# EAGLE design Metro Mini Rev B (EAGLE 9.6.2)
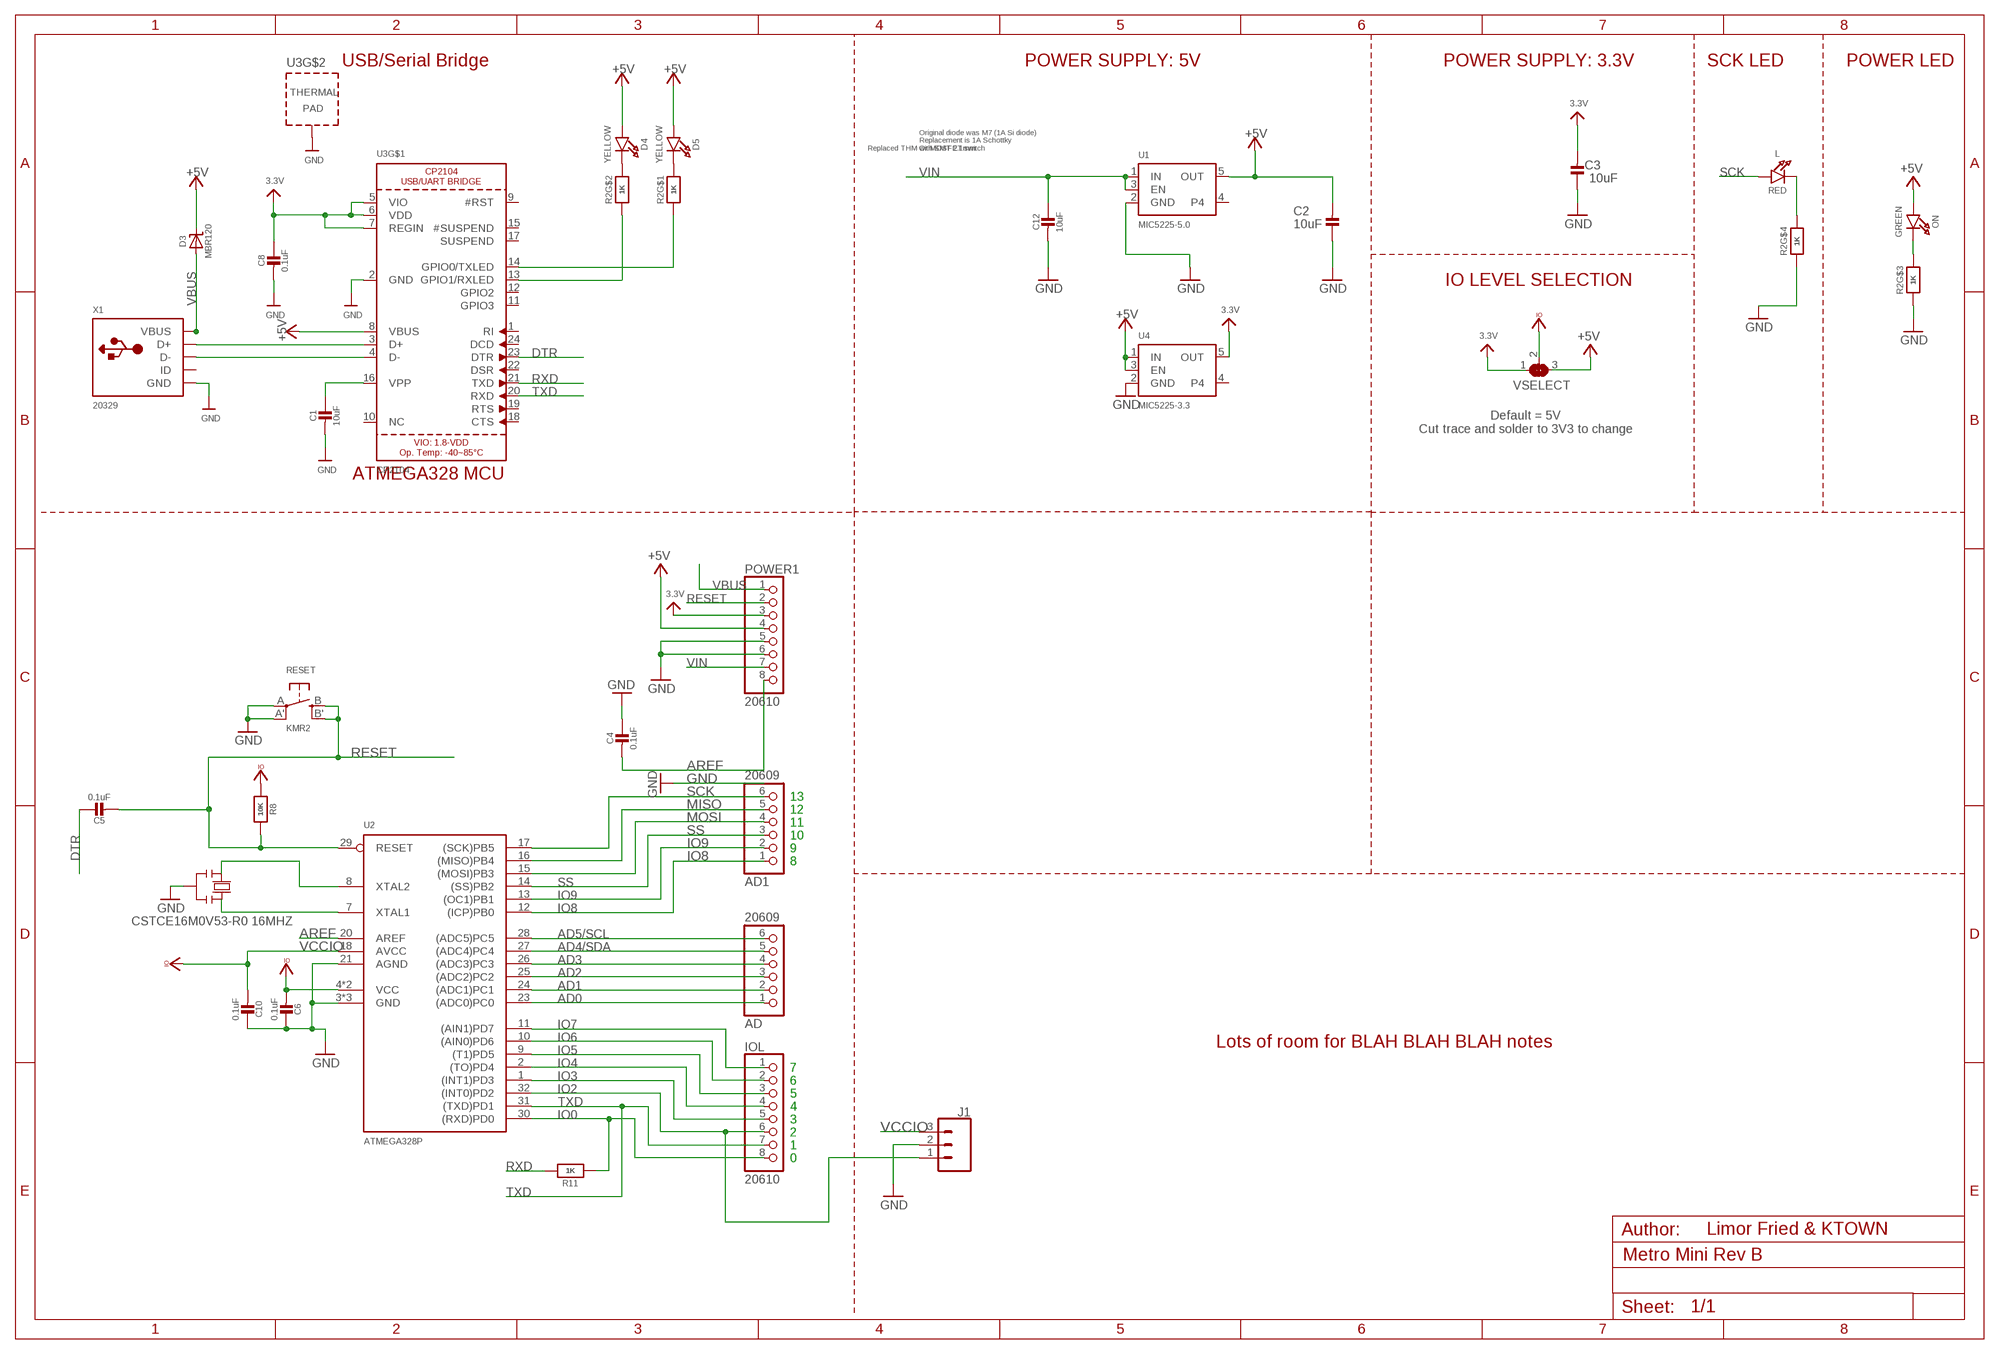
[diagram p0: schematic, sheet 1]

## Parts
AD  20609  HEADER-1X6ROUND  [1X06_ROUND]
AD1  20609  HEADER-1X6ROUND  [1X06_ROUND]
C1  10uF  CAP_CERAMIC0805-NOOUTLINE  [0805-NO]
C2  10uF  CAP_CERAMIC0805-NOOUTLINE  [0805-NO]
C3  10uF  CAP_CERAMIC0805-NOOUTLINE  [0805-NO]
C4  0.1uF  CAP_CERAMIC0805-NOOUTLINE  [0805-NO]
C5  0.1uF  CAP_CERAMIC_0805MP  [_0805MP]
C6  0.1uF  CAP_CERAMIC0805-NOOUTLINE  [0805-NO]
C8  0.1uF  CAP_CERAMIC0805-NOOUTLINE  [0805-NO]
C10  0.1uF  CAP_CERAMIC0805-NOOUTLINE  [0805-NO]
C12  10uF  CAP_CERAMIC0805-NOOUTLINE  [0805-NO]
D3  MBR120  DIODE-SCHOTTKYSOD-123  [SOD-123]
D4  YELLOW  LED0805_NOOUTLINE  [CHIPLED_0805_NOOUTLINE]
D5  YELLOW  LED0805_NOOUTLINE  [CHIPLED_0805_NOOUTLINE]
IOL  20610  HEADER-1X8ROUND  [1X08_ROUND]
J1  CONN_03  [1X03]
L  RED  LED0805_NOOUTLINE  [CHIPLED_0805_NOOUTLINE]
ON  GREEN  LED0805_NOOUTLINE  [CHIPLED_0805_NOOUTLINE]
POWER1  20610  HEADER-1X870MIL  [1X08_ROUND_70]
R2  1K  RESISTOR_4PACK  [RESPACK_4X0603]
R8  10K  RESISTOR0805_NOOUTLINE  [0805-NO]
R11  1K  RESISTOR0805_NOOUTLINE  [0805-NO]
RESET  KMR2  SWITCH_TACT_SMT4.6X2.8  [BTN_KMR2_4.6X2.8]
U1  MIC5225-5.0  VREG_SOT23-5  [SOT23-5]
U2  ATMEGA328P  [MLF32-TH]
U3  CP2104  [QFN24_4MM_SMSC]
U4  MIC5225-3.3  VREG_SOT23-5  [SOT23-5]
VSELECT  SOLDERJUMPER_2WAY  [SOLDERJUMPER_2WAY_OPEN_NOPASTE]
X1  20329  USB_MICRO_20329_V2  [4UCONN_20329_V2]
Y2  CSTCE16M0V53-R0 16MHZ  RESONATORMU  [RESONATOR]

## Nets
3.3V: C3.2 C8.1 POWER1.3 U3.5(VIO) U3.6(VDD) U3.7(REGIN) U4.5(OUT) VSELECT.1
+5V [usbvcc]: C2.2 D3.C D4.A D5.A ON.A POWER1.4 U1.5(OUT) U3.8(VBUS) U4.1(IN) U4.3(EN) VSELECT.3
AD0: AD.1 U2.23((ADC0)PC0)
AD1: AD.2 U2.24((ADC1)PC1)
AD2: AD.3 U2.25((ADC2)PC2)
AD3: AD.4 U2.26((ADC3)PC3)
AD4/SDA: AD.5 U2.27((ADC4)PC4)
AD5/SCL: AD.6 U2.28((ADC5)PC5)
AREF [aref]: C4.2 POWER1.8 U2.20(AREF)
DTR: C5.1 U3.23(DTR)
GND [gnd]: C1.2 C2.1 C3.1 C4.1 C6.1 C8.2 C10.1 C12.2 J1.2 POWER1.5 POWER1.6 R2.3 R2.4 RESET.A'(P1) RESET.A(P) U1.2(GND) U2.3(GND) U2.5(GND) U2.21(AGND) U2.TH(GND) U3.2(GND) U3.THERM(TP) U4.2(GND) X1.BASE@1(GND) X1.BASE@2(GND) X1.GND X1.SPRT@1(GND) X1.SPRT@2(GND) X1.SPRT@3(GND) X1.SPRT@4(GND) Y2.2
IO0: IOL.8 R11.1 U2.30((RXD)PD0)
IO2: IOL.6 J1.1 U2.32((INT0)PD2)
IO3: IOL.5 U2.1((INT1)PD3)
IO4: IOL.4 U2.2((TO)PD4)
IO5: IOL.3 U2.9((T1)PD5)
IO6: IOL.2 U2.10((AIN0)PD6)
IO7: IOL.1 U2.11((AIN1)PD7)
IO8: AD1.1 U2.12((ICP)PB0)
IO9: AD1.2 U2.13((OC1)PB1)
MISO: AD1.5 U2.16((MISO)PB4)
MOSI: AD1.4 U2.15((MOSI)PB3)
N$1: L.C R2.5
N$3: ON.C R2.6
N$4: R2.1 U3.14(GPIO0/TXLED)
N$6: D4.C R2.7
N$7: D5.C R2.8
N$8: U3.3(D+) X1.D+
N$11: U3.4(D-) X1.D-
N$12: C1.1 U3.16(VPP)
N$15: R2.2 U3.13(GPIO1/RXLED)
RESET: C5.2 POWER1.2 R8.1 RESET.B'(S1) RESET.B(S) U2.29(RESET)
RXD: R11.2 U3.21(TXD)
SCK: AD1.6 L.A U2.17((SCK)PB5)
SS: AD1.3 U2.14((SS)PB2)
TXD: IOL.7 U2.31((TXD)PD1) U3.20(RXD)
VBUS: D3.A POWER1.1 X1.VBUS
VCCIO [usbvcc]: C6.2 C10.2 J1.3 R8.2 U2.4(VCC) U2.6(VCC) U2.18(AVCC) VSELECT.2
VIN [power]: C12.1 POWER1.7 U1.1(IN) U1.3(EN)
XTAL1: U2.7(XTAL1) Y2.3
XTAL2: U2.8(XTAL2) Y2.1
Unconnected: U1.4 U3.1(RI) U3.9(#RST) U3.10(NC) U3.11(GPIO3) U3.12(GPIO2) U3.15(#SUSPEND) U3.17(SUSPEND) U3.18(CTS) U3.19(RTS) U3.22(DSR) U3.24(DCD) U4.4 X1.ID

## Notes on the sheet
- USB/Serial Bridge | POWER SUPPLY: 5V | POWER SUPPLY: 3.3V | SCK LED | POWER LED
- Replaced THM with SMT 2.1mm
- Original diode was M7 (1A Si diode)
  Replacement is 1A Schottky
  Or MOSFET switch
- IO LEVEL SELECTION
- Default = 5V
  Cut trace and solder to 3V3 to change
- ATMEGA328 MCU
- 13
- 12
- 11
- 10
- 9
- 8
- Lots of room for BLAH BLAH BLAH notes
- 7
- 6
- 5
- 4
- 3
- 2
- 1
- 0
- Limor Fried & KTOWN

## Library data of the parts
AD AD1 = microbuilder:HEADER-1X6: PIN HEADER
C1-C6 C8 C10 C12 = microbuilder:CAP_CERAMIC: Ceramic Capacitors For new designs, use the packages preceded by an '_' character since they are more reliable: The following footprints should be used on most boards: _0402 - Standard footprint for regular board layouts _0603 - Standard footprint for regular board layouts _0805 - Standard footprint for regular board layouts _1206 - Standard footprint for regular board layouts For extremely tight-pitch boards where space is at a premium, the following 'micro-pitch' footprints can be used (smaller pads, no silkscreen outline, etc.): _0402MP - Micro-pitch footprint for very dense/compact boards _0603MP - Micro-pitch footprint for very dense/compact boards _0805MP - Micro-pitch footprint for very dense/compact boards _1206MP - Micro-pitch footprint for very dense/compact boards
D3 = microbuilder:DIODE-SCHOTTKY
D4 D5 L ON = microbuilder:LED: LED 0603 - 0603 Surface Mount Package 2mA: Green LED - Low Power (3.9mcd, 2ma, 1.7Vf) - Digikey: 475-2709-2-ND Orange LED - Low Power (9.8mcd, 2ma, 1.8Vf) - Digikey: 475-1194-2-ND Red LED - Low Power (5mcd, 2ma, 1.8Vf) - Digikey: 475-1195-2-ND Yellow LED - Low Power (7mcd, 2ma, 1.8Vf) - Digikey: 475-1196-2-ND 5mA: Blue LED - Low Power (17mcd, 5ma, 2.9Vf) - Digikey: LNJ937W8CRACT-ND 0805 - 0805 Surface Mount Package 2mA: Red LED (8.8mcd, 2mA, 1.8Vf, Clear) - Low Power [Digikey: 475-2510-1-ND] Green LED (5mcd, 2mA, 1.8Vf, Clear) - Low Power [Digikey: 475-2730-1-ND] Yellow LED (11.3mcd, 2mA, 1.8Vf, Clear) - Low Power [Digikey: 475-2555-1-ND] 20mA: Red LED (104mcd, 20mA, Diffused) - LS R976 [Digikey: 475-1278-6-ND] Red LED (12mcd, 20mA, 2.0Vf, Clear) - APT2012EC [Digikey: 754-1128-1-ND] Green LED (15mcd, 20mA, 2.2Vf, Clear) - APT2012GC [Digikey: 754-1131-1-ND] Orange LED (160mcd, 20mA, 2.1Vf, Clear) - APT2012SECK [Digikey: 754-1130-1-ND] 1206 - 1206 Surface Mount Package Green LED (26mcd, 20mA, Diffused) - LG N971 [Digikey: 475-1407-6-ND] Red LED (15mcd, 20mA, Diffused) - LH N974 [Digikey: 475-1416-6-ND] Cree - Cree High-Power Surface Mount LEDs XPEBWT-L1-0000-00D50 - White 111lm 350mA 2.9Vf 6200K 110° XTEAWT-00-0000-00000LEE3 - White 114lm 350mA 2.85Vf 5000K 115° Everlight - Everlight 45-21 Series Surface Mount LEDs 45-21/QK2C-B2832AC2CB2/2T - Warm White 2000mcd 20mA 3.25Vf 3050K 120° 45-21/LK2C-B38452C4CB2/2T - Nuetral White 2000mcd 20mA 3.25Vf 4150K 120° 45-21/LK2C-B50634C6CB2/2T - Cold White 2200mcd 20mA 3.25Vf 5650K 120° PLCC2 Reverse Mount LS T77K-J1L2-1-0-2-R18-Z - Red 11.25mcd 2mA 1.8Vf 630nm 120° LO T77K-L1M2-24-Z - Orange 19.6mcd 2mA 1.8Vf 606nm 120° LY T77K-K2M1-26-Z - Yellow 15.7mcd 2mA 1.8Vf 587nm 120°
IOL POWER1 = microbuilder:HEADER-1X8: PIN HEADER
J1 = SparkFun-Connectors:CONN_03: Multi connection point. Often used as Generic Header-pin footprint for 0.1 inch spaced/style header connections On any of the 0.1 inch spaced packages, you can populate with these: Break Away Headers - Straight <https://www.sparkfun.com/products/116> (PRT-00116) Break Away Male Headers - Right Angle <https://www.sparkfun.com/products/553> (PRT-00553) Female Headers <https://www.sparkfun.com/products/115> (PRT-00115) Break Away Headers - Machine Pin <https://www.sparkfun.com/products/117> (PRT-00117) Break Away Female Headers - Swiss Machine Pin <https://www.sparkfun.com/products/743> (PRT-00743) Stackable Header - 3 Pin (Female, 0.1") <https://www.sparkfun.com/products/13875> (PRT-13875) For SCREWTERMINALS and SPRING TERMINALS visit here: Screw Terimnals on SparkFun.com <https://www.sparkfun.com/search/results?term=Screw+Terminals> (5mm/3.5mm/2.54mm spacing) This device is also useful as a general connection point to wire up your design to another part of your project. Our various solder wires solder well into these plated through hole pads. Hook-Up Wire - Assortment (Stranded, 22 AWG) <https://www.sparkfun.com/products/11375> (PRT-11375) Hook-Up Wire - Assortment (Solid Core, 22 AWG) <https://www.sparkfun.com/products/11367> (PRT-11367) View the entire wire category on our website here <https://www.sparkfun.com/categories/141> Special notes: Molex polarized connector foot print use with SKU : PRT-08232 with associated crimp pins and housings.
R2 = microbuilder:RESISTOR_4PACK: Resistor Packs (4 resistors) 4 x 0603 10K 1/16W - Digikey: YC164J-10KCT-ND
R8 R11 = microbuilder:RESISTOR: Resistors For new designs, use the packages preceded by an '_' character since they are more reliable: The following footprints should be used on most boards: _0402 - Standard footprint for regular board layouts _0603 - Standard footprint for regular board layouts _0805 - Standard footprint for regular board layouts _1206 - Standard footprint for regular board layouts For extremely tight-pitch boards where space is at a premium, the following 'micro-pitch' footprints can be used (smaller pads, no silkscreen outline, etc.): _0402MP - Micro-pitch footprint for very dense/compact boards _0603MP - Micro-pitch footprint for very dense/compact boards _0805MP - Micro-pitch footprint for very dense/compact boards _1206MP - Micro-pitch footprint for very dense/compact boards
RESET = microbuilder:SWITCH_TACT_SMT: SMT Tact Switches 6x6mm - Digikey: P12940SCT-ND KMR2 (4.6x2.8mm) - Digikey: 401-1426-1-ND EVQ-PQHB55 - Light Touch, 160GF (4.5x4.5mm) - Digikey: P8090SCT-ND KMT0 - KMT021 NGJ LHS (etc.) IP68/Waterproof - Digikey: CKN10289CT-ND
U1 U4 = microbuilder:VREG_SOT23-5: SOT23-5 Fixed Voltage Regulators Part Current Out V Out V In V Dropout θJA (°C/W) TJ (°C) Digikey Part No. ADP121 150mA 3.3V 3.4-5.5V 0.09V @ 150mA -- -- ADP121-AUJZ33R7CT-ND ADP121 150mA 3.0V 3.1-5.5V 0.09V @ 150mA -- -- ADP121-AUJZ30R7CT-ND ADP122 300mA 3.3V 3.4-5.5V 0.085V @ 300mA -- -- ADP122AUJZ-3.3-R7CT-ND ADP1712 300mA 3.3V 3.5-5.5V 0.17V @ 300mA -- -- ADP1712AUJZ-3.3-R7TR-ND AP7311 (Low Cost) 150mA 3.3V 3.5-6V 0.15V @ 150mA -- -- AP7311-33WG-7DICT-ND LD39015M18R 150mA 1.8V 1.9V-5.5V 0.08V @ 100mA -- -- 497-6977-1-ND LP2985A-33DBVR 150mA 3.3V 3.3-16V 0.28V @ 150mA 206 150 296-18479-1-ND MCP1824T-3302E/OT 300mA 3.3V 3.5V-6V 0.2V @ 300mA -- -- MCP1824T-3302E/OTCT-ND MIC5205-2.5YM5 TR 150mA 2.5V 2.7-16V 0.165V @ 150mA -- -- 576-1257-2-ND MIC5205-3.0YM5 TR 150mA 3.0V 3.2V-16V 0.165V @ 150mA -- -- 576-1258-2-ND MIC5205-3.3YM5 TR 150mA 3.3V 3.5V-16V 0.165V @ 150mA -- -- 576-1259-2-ND TPS780330220 150mA 3.3V+2.2V 3.6-5.5V 250mV Max -- -- 296-23332-1-ND TDA3663/N1,135 100mA 3.3V 3.5-45V 0.18V @ 50mA -- -- 568-5343-1-ND Max operating temp can be calculated using θJA, TJ (max junction temperature), and power in watts. Set the "Maximum Ambient Temperature" until it reaches TJ ("Max Junction Temperature"), which is the absolute limit for safe use of the regulator: Heat Sink Temperature Calculator <http://www.daycounter.com/Calculators/Heat-Sink-Temperature-Calculator.phtml> For example, With 12V source into a 3.3V LP2985 and a 30mA load, we are dissipating (12V-3.3V) * 0.03A = 0.261W. With a θJA of 206 °C/W, a TJ of 150°C, and 261mW we can safely use the chip without a heat sink up to 75°C (=147.1°C Junction Temperature).
U2 = microbuilder:ATMEGA328P: ATMEGA 328P
U3 = microbuilder:CP2104: CP2104 - USB to UART Bridge VDD Output: 3.45V
VSELECT = microbuilder:SOLDERJUMPER_2WAY: 2-Way Solder Jumper
X1 = microbuilder:USB: USB Connectors USBMINIB - Surface Mount Female Mini-B USB Connector 4UConnector: 06564
Y2 = SmartPrj:RESONATOR

## Net classes
1 power: width 0.305 mm, drill 0.483 mm, clearance 0.203 mm
2 gnd: width 0.305 mm, drill 0.483 mm, clearance 0.203 mm
3 usbvcc: width 0.305 mm, drill 0.483 mm, clearance 0.203 mm
4 aref: width 0.254 mm, drill 0.483 mm, clearance 0.203 mm

## Board
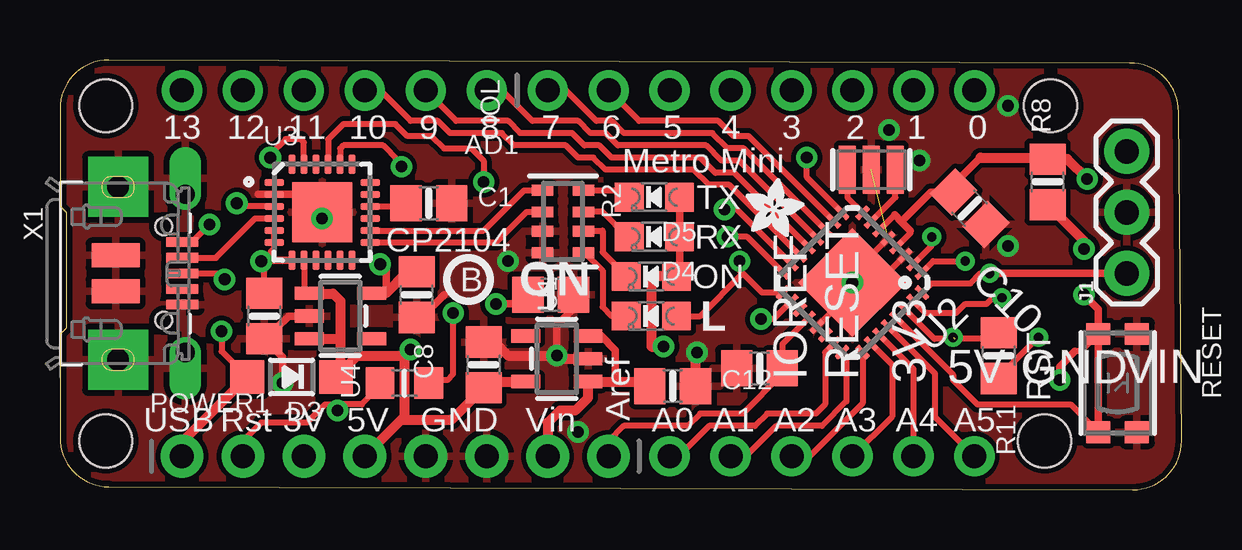
[diagram p1: board, top side]
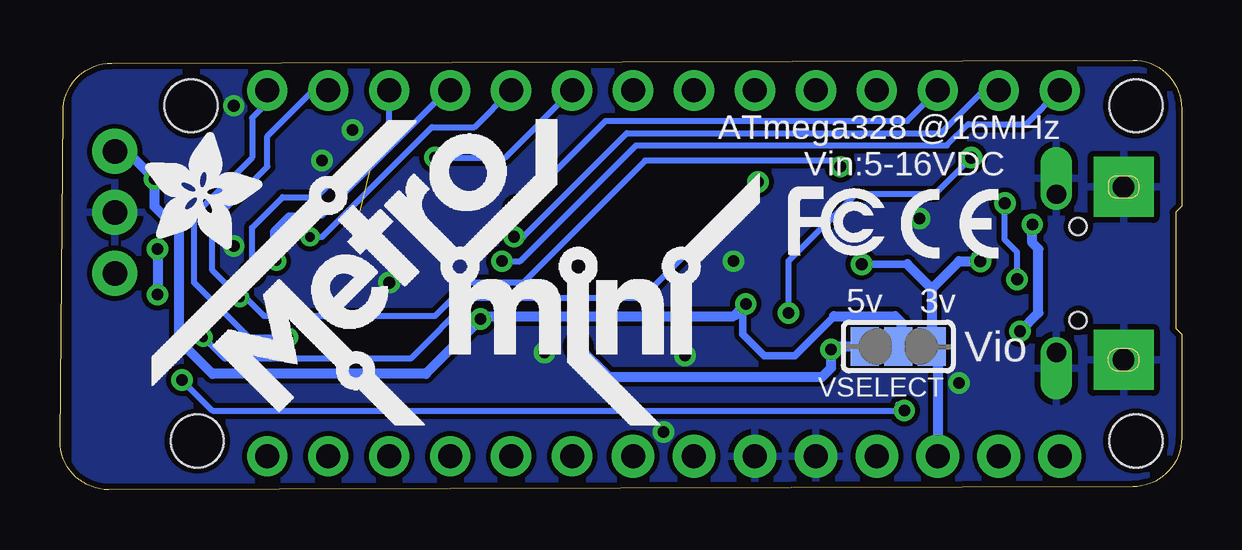
[diagram p2: board, bottom side, seen from below]

Size 46.74 x 17.91 mm. Coordinates in mm from the lower left corner, seen from the top.
Outline: 0,15.88 0,11.81 0.25,11.56 0.25,6.73 0,6.48 0,2.16 arc90 2.03,0.13 44.7,0 arc90 46.74,2.03 46.61,15.75 arc90 44.58,17.78 2.03,17.91 arc90 0,15.88
Copper layers (1*16): Top 0.035mm / dielectric 1.5mm / Bottom 0.035mm
Design rules "adafruit *": minimum track width 8mil, minimum drill 15.5mil, track to track 8mil, track to pad 8mil, pad to pad 8mil, via to via 8mil, smd to smd 8mil, copper to edge 10mil, drill to drill 8mil, minimum pad ring 10mil, minimum via ring 8mil, stop-mask expansion 2mil, vias tented up to drill 20mil, thermal gap 10mil
Holes 2.2 mm at 1.91,16 1.91,2.03 41.27,16 41.02,2.03

### Footprints (pad centres in the part's own frame; a part is rotated, then mirrored left to right if it is on the bottom)
1X06_ROUND = drill 1 pad 1.676: 1 -6.35,0; 2 -3.81,0; 3 -1.27,0; 4 1.27,0; 5 3.81,0; 6 6.35,0
0805-NO = smd 1.3 x 1.5: 1 -0.95,0; 2 0.95,0
_0805MP = smd 1.2 x 1.3: 1 -1.016,0; 2 1.016,0
SOD-123 = smd 1.4 x 1.4: A 1.85,0; C -1.85,0
CHIPLED_0805_NOOUTLINE = smd 1.2 x 1.2: A 0,-1.05; C 0,1.05
1X08_ROUND = drill 1 pad 1.676: 1 -8.89,0; 2 -6.35,0; 3 -3.81,0; 4 -1.27,0; 5 1.27,0; 6 3.81,0; 7 6.35,0; 8 8.89,0
1X03 = drill 1.016 pad 1.88: 1 0,0; 2 2.54,0; 3 5.08,0
1X08_ROUND_70 = drill 1 pad 1.778: 1 -8.89,0; 2 -6.35,0; 3 -3.81,0; 4 -1.27,0; 5 1.27,0; 6 3.81,0; 7 6.35,0; 8 8.89,0
RESPACK_4X0603 = smd 0.45 x 0.9: 1 -1.3,-0.85; 2 -0.4,-0.85; 3 0.4,-0.85; 4 1.3,-0.85; 5 1.3,0.85; 6 0.4,0.85; 7 -0.4,0.85; 8 -1.3,0.85
BTN_KMR2_4.6X2.8 = smd 0.9 x 1: A 2.05,0.8; A' -2.05,0.8; B 2.05,-0.8; B' -2.05,-0.8
SOT23-5 = smd 0.55 x 1.2: 1 -0.95,-1.3; 2 0,-1.3; 3 0.95,-1.3; 4 0.95,1.3; 5 -0.95,1.3
MLF32-TH = smd 0.7 x 0.25: 1 -2.35,1.75; 2 -2.35,1.25; 3 -2.35,0.75; 4 -2.35,0.25; 5 -2.35,-0.25; 6 -2.35,-0.75; 7 -2.35,-1.25; 8 -2.35,-1.75; 17 2.35,-1.75; 18 2.35,-1.25; 19 2.35,-0.75; 20 2.35,-0.25; 21 2.35,0.25; 22 2.35,0.75; 23 2.35,1.25; 24 2.35,1.75 | smd 0.25 x 0.7: 9 -1.75,-2.35; 10 -1.25,-2.35; 11 -0.75,-2.35; 12 -0.25,-2.35; 13 0.25,-2.35; 14 0.75,-2.35; 15 1.25,-2.35; 16 1.75,-2.35; 25 1.75,2.35; 26 1.25,2.35; 27 0.75,2.35; 28 0.25,2.35; 29 -0.25,2.35; 30 -0.75,2.35; 31 -1.25,2.35; 32 -1.75,2.35 | smd 3.2 x 3.2: TH 0,0
QFN24_4MM_SMSC = smd 0.8 x 0.28: 1 -2,1.25; 2 -2,0.75; 3 -2,0.25; 4 -2,-0.25; 5 -2,-0.75; 6 -2,-1.25; 13 2,-1.25; 14 2,-0.75; 15 2,-0.25; 16 2,0.25; 17 2,0.75; 18 2,1.25 | smd 0.28 x 0.8: 7 -1.25,-2; 8 -0.75,-2; 9 -0.25,-2; 10 0.25,-2; 11 0.75,-2; 12 1.25,-2; 19 1.25,2; 20 0.75,2; 21 0.25,2; 22 -0.25,2; 23 -0.75,2; 24 -1.25,2 | smd 2.5 x 2.5: THERM 0,0
SOLDERJUMPER_2WAY_OPEN_NOPASTE = smd 1.168 x 1.6: 1 -1.397,0; 2 0,0; 3 1.397,0
4UCONN_20329_V2 = smd 1 x 2: BASE@1 -0.75,-2; BASE@2 0.75,-2 | smd 0.4 x 1.35: D+ 0,0.775; D- -0.65,0.775; GND 1.3,0.775; ID 0.65,0.775; VBUS -1.3,0.775 | drill 0.8 pad 1.2 offset: SPRT@1 -3.3,0.9; SPRT@2 3.3,0.9 | drill 0.9 pad 2.5 square: SPRT@3 -3.6,-1.9; SPRT@4 3.6,-1.9 | hole 0.7: -1.95,0; 1.95,0
RESONATOR = smd 0.7 x 2: 1 -1,0; 2 0,0; 3 1,0

### Placement (x,y rotation side)
AD  31.75,1.4 0 top
AD1  11.43,16.64 180 top
C1  15.37,11.94 0 top
C2  17.65,5.21 270 top
C3  8.51,7.24 90 top
C4  29.15,5.06 0 top
C5  14.35,4.44 180 top
C6  20.45,8.13 180 top
C8  14.86,8.13 270 top
C10  37.9,11.73 135 top
C12  25.53,4.32 0 top
D3  9.65,4.7 180 top
D4  24.77,10.54 90 top
D5  24.77,12.19 90 top
IOL  29.21,16.64 0 top
J1  44.45,9.02 90 top
L  24.64,7.24 90 top
ON  24.64,8.89 90 top
POWER1  13.97,1.4 0 top
R2  20.95,11.18 270 top
R8  41.15,12.83 90 top
R11  39.12,5.59 270 top
RESET  44.07,4.44 270 top
U1  20.7,5.46 90 top
U2  33.02,8.64 225 top
U3  10.92,11.56 0 top
U4  11.68,7.24 270 top
U$4  [PCBFEAT-REV-040]  17.02,8.76 0 top
U$5  [ADAFRUIT_2.5MM]  28.57,10.54 0 top
U$7  [METROMINI_SILK]  42.93,2.67 0 bottom
U$10  [ADAFRUIT_5MM]  43.18,10.03 0 bottom
U$12  [SYMBOL_CE_TINY]  11.68,9.65 0 bottom
U$14  [SYMBOL_FCC_TINY]  16.38,9.78 0 bottom
VSELECT  11.81,5.97 180 bottom
X1  4.32,9.02 270 top
Y2  33.8,13.34 0 top

### Tracks (layer width: path | path; a pad name or v marks a point on that pad's centre or on a via)
3.3V  (via drill 0.5)
  Top 0.254: U3.5 U3.6 8.92,10.05 8.76,9.89 8.76,9.53 v8.38,9.53 8.51,9.4 C3.2
  Top 0.305: U3.7 8.41,9.56 v8.38,9.53 | v13.34,9.4 13.59,9.14 13.59,8.19
  Top 0.406: U4.5 13.59,8.19 14.48,9.08 C8.1
  Bottom 0.254: 8.64,9.78 v8.38,9.53
  Bottom 0.305: 11.43,9.4 v13.34,9.4
  Bottom 0.406: POWER1.3 10.16,5.71 VSELECT.1 10.41,8.38 | 11.43,9.4 10.41,8.38 | 10.41,8.38 9.27,9.53 v8.38,9.53
+5V  (via drill 0.48)
  Top 0.254: U3.8 10.17,8.19
  Top 0.305: D5.A D4.A 25.82,9.02 ON.A | 10.17,8.19 U4.1
  Top 0.406: 11.3,4.7 D3.C | ON.A 24.64,8.89 24.64,5.97 v25.15,5.97 | 14.35,5.59 14.35,2.92 | POWER1.4 14.22,2.92 14.35,2.92 | 14.35,2.92 16.32,2.92 C2.2 17.91,4.51 U1.5 | D3.C 12.39,5.59 14.35,5.59 | v14.61,5.84 14.35,5.59 | U4.1 11.38,8.18 11.68,7.87 11.68,6.22 | 11.68,6.22 11.68,4.88 D3.C | U4.3 11.62,6.29 11.68,6.22
  Bottom 0.406: v25.15,5.97 23.88,4.7 14.99,4.7 14.61,5.08 v14.61,5.84 14.48,5.97 VSELECT.3
AD0
  Top 0.254: U2.23 31.88,5.72 31.88,3.56 31.5,3.17 29.46,3.17 28.96,2.67 27.05,2.67 25.78,1.4 AD.1
AD1
  Top 0.254: U2.24 32.77,5.57 32.77,3.68 31.75,2.67 29.84,2.67 28.57,1.4 AD.2
AD2
  Top 0.254: U2.25 33.44,3.6 31.24,1.4 AD.3
AD3
  Top 0.254: U2.26 34.67,5.22 34.67,3.05 AD.4
AD4/SDA
  Top 0.254: U2.27 35.56,5.04 AD.5
AD5/SCL
  Top 0.254: U2.28 36.45,4.85 36.45,3.05 AD.6
AREF
  Top 0.254: U2.20 30.1,6.07 C4.2 30.1,4.83 28.45,3.17 26.67,3.17 26.16,2.67 23.5,2.67 22.86,2.03 POWER1.8
DTR  (via drill 0.48, 0.5)
  Top 0.254: v16.38,7.37 16.38,4.83 16.13,4.57 15.49,4.57 C5.1 | U3.23 10.16,13.57 10.16,14.48 10.03,14.61 9.4,14.61 8.76,13.97 v8.76,13.84
  Bottom 0.254: v8.76,13.84 10.29,12.32 13.59,12.32 16.38,9.53 v16.38,7.37
GND  (via drill 0.48, 0.5)  (1 unrouted)
  Top 0.254: U2.5 33.22,9.19 | 33.22,9.19 33.02,8.99 U2.TH 34.08,8.64 U2.3 | U2.21 33.22,8.49 33.22,9.19
  Top 0.305: 21.4,7.55 20.7,6.86 v20.7,5.59 | U3.THERM 10.17,12.31 U3.2 8.27,12.31 | v9.27,4.44 9.27,5.53 C3.1 8.95,6.73 9.02,6.73 9.53,7.24 U4.2 | C8.2 15.05,7.18 16,8.13
  Top 0.406: 26.48,5.37 C12.2 | U1.2 20.83,5.46 v20.7,5.59 18.67,5.59 17.97,6.28 | 21.4,7.55 C6.1
  other vias: 33.02,8.64 39.5,16 21.59,2.41 34.54,14.99 39.5,10.16 26.54,5.71 18.67,9.53 10.92,11.3 35.81,13.72
  pour Top: 0,17.91 0,0.13 46.61,0.13 46.61,17.91
  pour Bottom: 0,17.91 0,0.13 46.1,0.13 46.1,17.91
IO0  (via drill 0.39)  (1 unrouted)
  Top 0.254: U2.30 36.43,6.28 37.15,6.28 v37.21,6.35 | 39.69,6.54 R11.1 38.86,6.28 37.27,6.28
  Bottom 0.254: 36.96,6.35 v37.21,6.35 38.86,6.35 41.15,8.64 41.15,11.43 38.73,13.84 38.73,15.49 37.85,16.38 IOL.8
IO2  (via drill 0.39)
  Top 0.254: U2.32 36.3,8.59 37.93,8.59 38.35,9.02 v38.73,9.02
  Top 0.305: v38.73,9.02 J1.1
  Bottom 0.254: v38.73,9.02 38.73,10.92 37.47,12.19 36.07,12.19 33.02,15.24 IOL.6
IO3  (via drill 0.39)
  Top 0.254: U2.1 36.38,9.53 v37.72,9.53
  Bottom 0.254: v37.72,9.53 37.85,9.65 37.85,10.79 37.21,11.43 35.81,11.43 30.61,16.64 IOL.5
IO4  (via drill 0.39)
  Top 0.254: U2.2 36.32,10.17 v36.32,10.54
  Bottom 0.254: v36.32,10.54 35.81,10.54 31.24,15.11 29.46,15.11 IOL.4
IO5  (via drill 0.48)
  Top 0.254: U2.9 31.11,13.02 v31.11,13.84
  Bottom 0.254: v31.11,13.84 28.19,13.84 IOL.3
IO6
  Top 0.254: U2.10 28.69,14.73 28.07,14.73 27.43,15.37 24.13,15.37 IOL.2
IO7
  Top 0.254: U2.11 28.49,14.22 27.81,14.22 27.18,14.86 23.5,14.86 22.99,15.37 22.35,15.37 21.08,16.64 IOL.1
IO8
  Top 0.254: U2.12 28.29,13.72 27.56,13.72 26.92,14.35 23.24,14.35 22.73,14.86 22.1,14.86 21.59,15.37 19.68,15.37 18.41,16.64 AD1.1
IO9
  Top 0.254: U2.13 28.09,13.21 27.3,13.21 26.67,13.84 22.99,13.84 22.48,14.35 21.84,14.35 21.34,14.86 19.18,14.86 18.67,15.37 16.51,15.37 AD1.2
MISO  (via drill 0.48)
  Top 0.254: U2.16 28.64,10.54 v27.81,10.54
  Bottom 0.254: v27.81,10.54 27.43,10.54 23.11,14.86 10.03,14.86 8.26,16.64 AD1.5
MOSI  (via drill 0.48)
  Top 0.254: U2.15 28.2,11.68 v27.69,11.68
  Bottom 0.254: v27.69,11.68 24,15.37 11.43,15.37 AD1.4
N$1
  Top 0.254: L.C 22.99,7.24 22.61,7.62 22.61,9.14 21.87,9.88 R2.5
N$2
  Bottom 0.254: 12.06,5.97 12.95,5.97
N$3
  Top 0.254: 21.74,10.78 R2.6 22.59,10.78 22.61,10.79 22.61,9.91 23.59,8.92 ON.C 23.46,9.02
N$4
  Top 0.254: U3.14 12.93,10.79 17.65,10.79 19.33,12.48 R2.1
N$6
  Top 0.254: 22.08,11.58 R2.7 22.59,11.58 23.62,10.54 D4.C
N$7
  Top 0.254: R2.8 23.43,12.48 D5.C
N$8  (via drill 0.5)
  Top 0.254: 7.49,11.81 v7.37,11.94 7.5,11.81 U3.3 | X1.D+ 6.6,9.02 v6.86,8.76
  Bottom 0.254: v6.86,8.76 6.86,9.91 7.37,10.41 v7.37,11.94
N$11
  Top 0.254: X1.D- 6.49,9.67 8.13,11.3 U3.4
N$12
  Top 0.254: U3.16 14.29,11.81 C1.1
N$15
  Top 0.254: U3.13 18.18,10.31 19.45,11.58 R2.2
RESET  (via drill 0.48)
  Top 0.254: 43.27,2.45 RESET.B 42.11,3.56 38.23,3.56 37.21,4.57 37.21,4.8 U2.29 | 43.27,6.57 RESET.B' 42.55,5.77 42.29,5.77 | 11.56,3.56 12.57,3.56 13.34,4.32 C5.2 | POWER1.2 7.62,2.03 8.38,2.79 10.29,2.79 11.05,3.56 11.56,3.56 | 11.56,3.56 v11.56,3.3
  Top 0.305: RESET.B RESET.B' 43.27,7.53 v42.67,8.13 | 42.29,5.77 41.66,5.14 v41.66,4.57
  Top 0.406: R8.1 42.67,10.35 v42.67,10.03
  Bottom 0.254: v11.56,3.3 11.81,3.56 | v41.66,4.57 40.39,3.3 v11.56,3.3 | 11.3,3.3 v11.56,3.3
  Bottom 0.406: v42.67,10.03 v42.67,8.13
RXD  (via drill 0.39, 0.48)
  Top 0.254: R11.2 39.12,4.7 v40.77,6.35 | U3.21 11.17,14.6 11.81,15.24 13.97,15.24 14.48,14.73 15.49,14.73 16,14.22 17.14,14.22 17.65,13.72 v17.65,12.83
  Bottom 0.254: v40.77,6.35 39.88,5.46 32.13,5.46 29.59,8 22.48,8 v17.65,12.83
SCK  (via drill 0.48)
  Top 0.254: U2.17 29.25,8.21 28.45,9.02 | 28.45,9.02 28.32,9.14 v28.32,9.53 | L.A 26.67,7.24 28.45,9.02
  Bottom 0.254: v28.32,9.53 27.56,9.53 22.73,14.35 9.78,14.35 8.89,15.24 6.48,15.24 AD1.6
SS
  Top 0.254: U2.14 27.89,12.7 27.05,12.7 26.42,13.34 22.73,13.34 22.23,13.84 21.59,13.84 21.08,14.35 18.92,14.35 18.41,14.86 16.26,14.86 15.75,15.37 14.61,15.37 13.34,16.64 AD1.3
TXD  (via drill 0.39, 0.48)
  Top 0.254: U2.31 36.06,7.37 37.34,7.37 37.72,7.75 38.61,7.75 38.86,8 v39.24,8 | v14.22,13.46 14.22,13.72 14.1,13.72 13.46,14.35 11.81,14.35 11.67,14.21 U3.20
  Bottom 0.254: v14.22,13.46 14.48,13.72 22.35,13.72 27.43,8.64 29.72,8.64 31.11,7.24 38.23,7.24 38.99,8 v39.24,8 40.39,9.14 40.39,11.18 38.1,13.46 38.1,14.73 36.32,16.51 35.69,16.51 IOL.7
VBUS  (via drill 0.48)
  Top 0.254: X1.VBUS 5.49,10.32 v6.22,11.05 | v6.73,6.6 6.73,5.77 D3.A
  Top 0.406: D3.A 5.08,1.98 POWER1.1
  Bottom 0.406: v6.73,6.6 5.97,7.37 5.97,10.03 6.22,10.29 v6.22,11.05
VCCIO  (via drill 0.48)
  Top 0.254: U2.6 34.78,11.45 | U2.4 35.43,10.7 35.43,10.79 | 34.78,11.45 | U2.18 29.73,7.11 v29.21,7.11
  Top 0.305: 35.43,10.79 35.05,11.18 | 35.05,11.18 34.78,11.45 | 38.35,13.84 37.23,12.72 C10.2 36.28,12.4 35.05,11.18 | C6.2 19.5,7.75 v18.16,7.75 | 41.08,13.84 R8.2
  Top 0.406: 38.35,13.84 41.08,13.84 | 42.8,12.7 v42.8,12.95 41.98,13.78 R8.2
  Bottom 0.305: 14.48,7.24 16.13,5.59 17.4,5.59 18.29,6.48 18.29,7.62 18.16,7.62 v18.16,7.75
  Bottom 0.406: v18.16,7.75 18.29,7.62 18.67,7.24 29.08,7.24 v29.21,7.11 31.5,4.83 40.39,4.83 41.78,6.22 41.78,10.79 42.8,11.81 v42.8,12.95 44.2,14.35 J1.3 | 14.48,7.24 11.94,7.24 11.68,6.98 11.68,6.1 VSELECT.2
VIN
  Top 0.305: U1.3 22.55,6.41 23.14,5.82 23.14,4.61
  Top 0.406: POWER1.7 20.32,2.79 20.83,3.3 21.46,3.3 22,3.84 U1.1 23.24,4.51 | 23.14,4.61 23.24,4.51 | 24.26,4.64 C12.1 24.38,4.51 23.24,4.51
XTAL1
  Top 0.254: U2.7 34.8,12.19 Y2.3
XTAL2
  Top 0.254: Y2.1 32.8,12.18 U2.8

### Text on the board
tPlace: 13 | 12 | 11 | 10 | 9 | 8 | 7 | 6 | 5 | 4 | 3 | 2 | 1 | 0 | Metro Mini | TX | CP2104 | RX | ON | Aref | RST | USB | Rst | 3V | 5V | GND | Vin | A0 | A1 | A2 | A3 | A4 | A5
bPlace: ATmega328 @16MHz | Vin:5-16VDC | 3v | 5v | Vio
tNames: IOREF | RESET | 3V3 | 5V | GND | VIN
ReferenceLC: PC1 | PC2
214bmp: D:/SmartProjects/Snc/a4_bn_logo2.bmp